# Altium schematic sheet CAMERA.SchDoc
size B
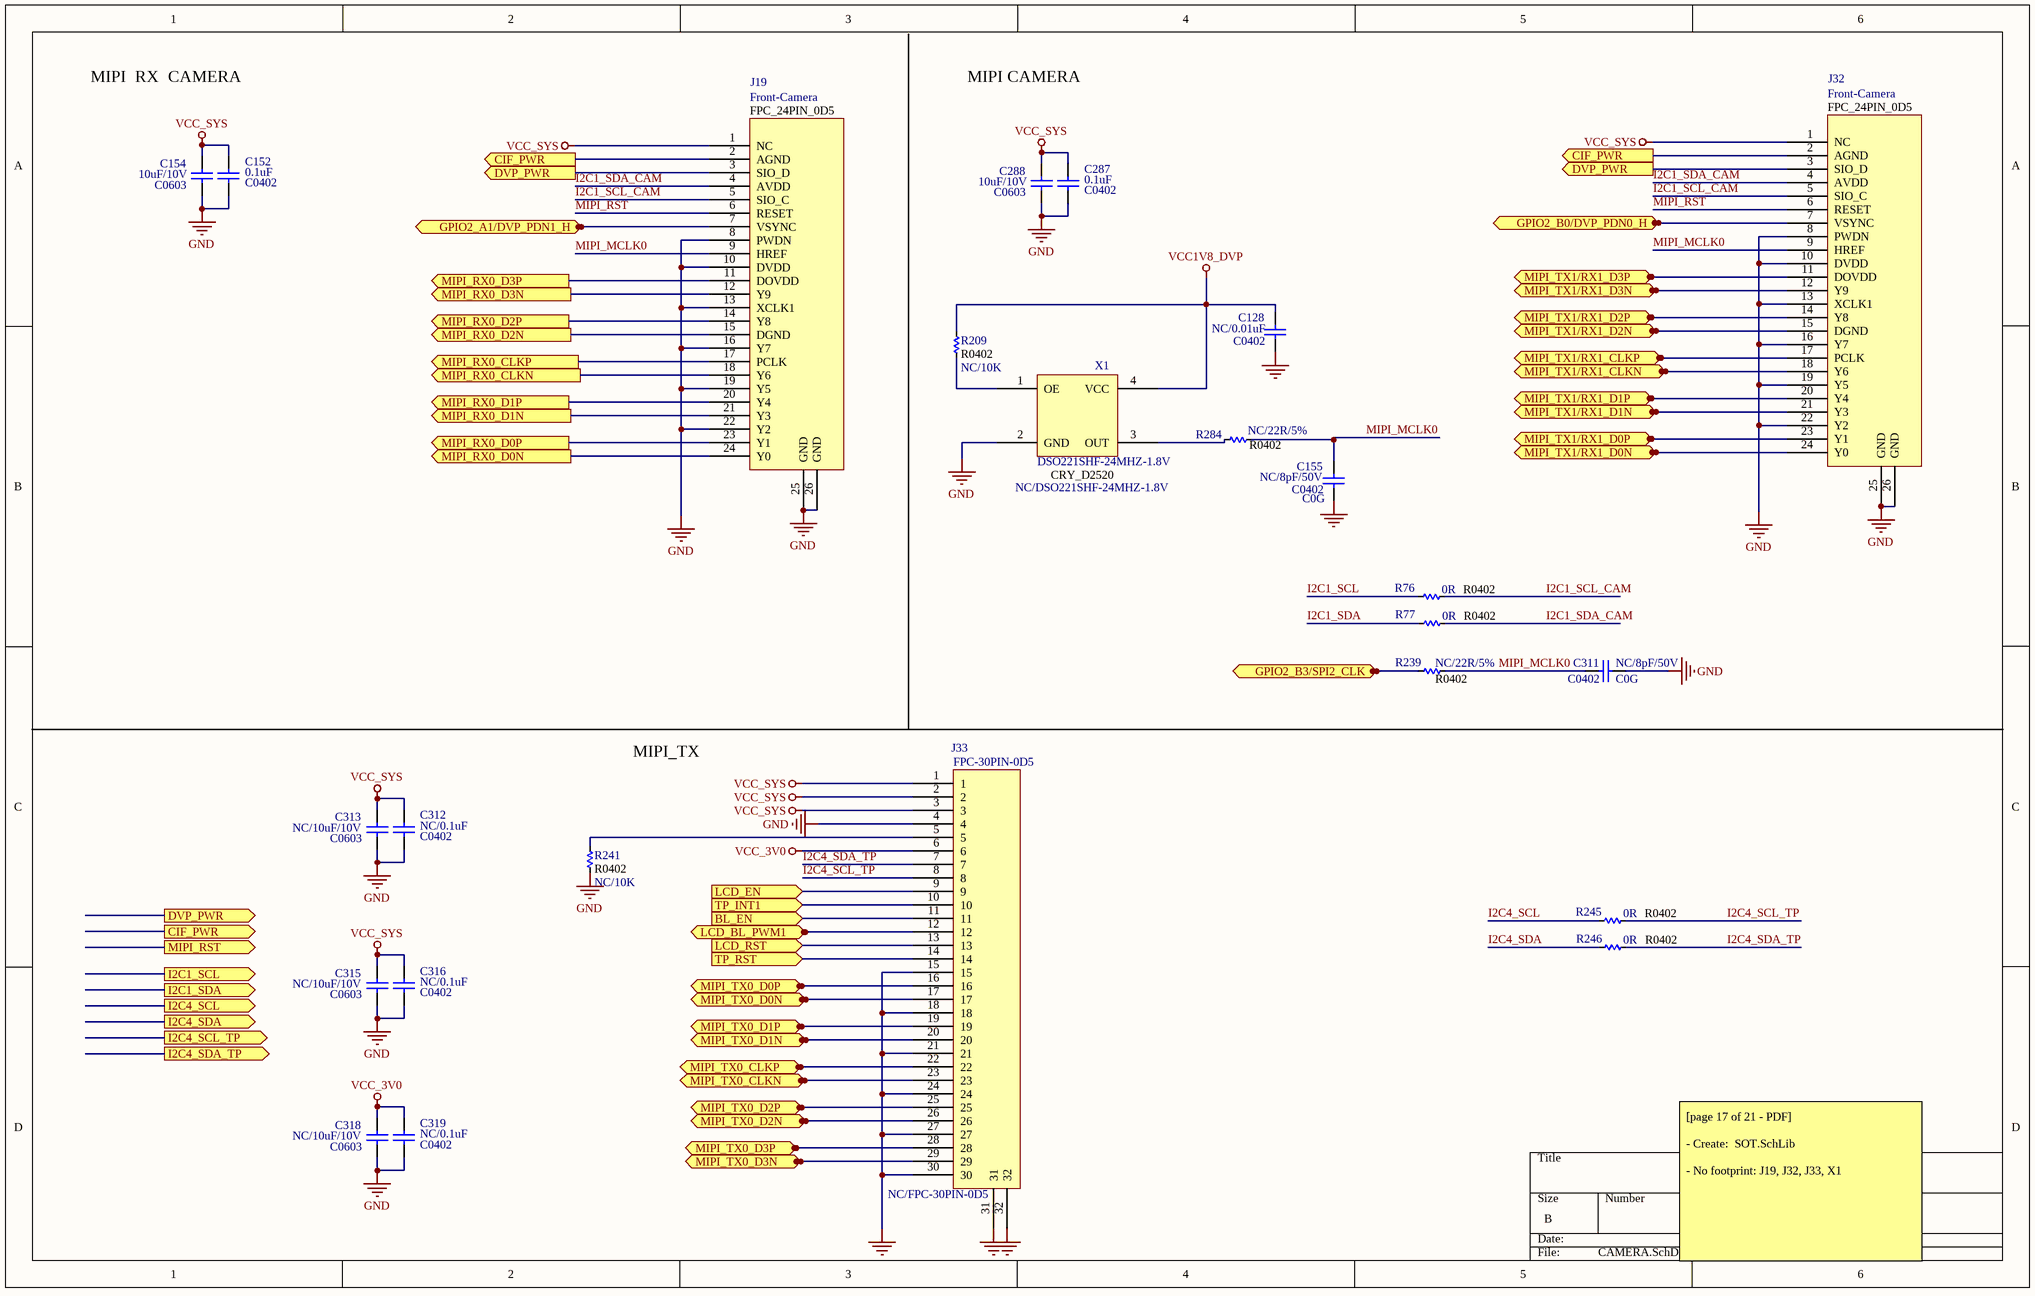
[diagram p0: CAMERA.SchDoc]

## Parts
C128  C0402  value NC/0.01uF  [C 0402]
C152  C0402  value 0.1uF  [C 0402]
C154  C0603  value 10uF/10V  [C 0603]
C155  C0402  value NC/8pF/50V  [C 0402]
C287  C0402  value 0.1uF  [C 0402]
C288  C0603  value 10uF/10V  [C 0603]
C311  C0402  value NC/8pF/50V  [C 0402]
C312  C0402  value NC/0.1uF  [C 0402]
C313  C0603  value NC/10uF/10V  [C 0603]
C315  C0603  value NC/10uF/10V  [C 0603]
C316  C0402  value NC/0.1uF  [C 0402]
C318  C0603  value NC/10uF/10V  [C 0603]
C319  C0402  value NC/0.1uF  [C 0402]
J19  FPC_24PIN_0D5  [FPC-24Pin]  (value not drawn)
J32  FPC_24PIN_0D5  [FPC-24Pin]  (value not drawn)
J33  NC/FPC-30PIN-0D5  [FPC-30pin]
R76  R0402  value 0R  [R 0402]
R77  R0402  value 0R  [R 0402]
R209  R0402  value NC/10K  [R 0402]
R239  R0402  value NC/22R/5%  [R 0402]
R241  R0402  value NC/10K  [R 0402]
R245  R0402  value 0R  [R 0402]
R246  R0402  value 0R  [R 0402]
R284  R0402  value NC/22R/5%  [R 0402]
X1  CRY_D2520  [Crystal 4-SMD 32x25]  (value not drawn)

## Ports
BL_EN (in), CIF_PWR (out), DVP_PWR (out), GPIO2_A1/DVP_PDN1_H (in), GPIO2_B0/DVP_PDN0_H (in), GPIO2_B3/SPI2_CLK (in), I2C1_SCL (out), I2C1_SDA (out), I2C4_SCL (out), I2C4_SCL_TP (out), I2C4_SDA (out), I2C4_SDA_TP (out), LCD_BL_PWM1 (in), LCD_EN (in), LCD_RST (in), MIPI_RST (out), MIPI_RX0_CLKN (out), MIPI_RX0_CLKP (out), MIPI_RX0_D0N (out), MIPI_RX0_D0P (out), MIPI_RX0_D1N (out), MIPI_RX0_D1P (out), MIPI_RX0_D2N (out), MIPI_RX0_D2P (out), MIPI_RX0_D3N (out), MIPI_RX0_D3P (out), MIPI_TX0_CLKN (in), MIPI_TX0_CLKP (in), MIPI_TX0_D0N (in), MIPI_TX0_D0P (in), MIPI_TX0_D1N (in), MIPI_TX0_D1P (in), MIPI_TX0_D2N (in), MIPI_TX0_D2P (in), MIPI_TX0_D3N (in), MIPI_TX0_D3P (in), MIPI_TX1/RX1_CLKN (out), MIPI_TX1/RX1_CLKP (out), MIPI_TX1/RX1_D0N (out), MIPI_TX1/RX1_D0P (out), MIPI_TX1/RX1_D1N (out), MIPI_TX1/RX1_D1P (out), MIPI_TX1/RX1_D2N (out), MIPI_TX1/RX1_D2P (out), MIPI_TX1/RX1_D3N (out), MIPI_TX1/RX1_D3P (out), TP_INT1 (in), TP_RST (in)

## Nets
GND: C128.2 C152.2 C154.2 C155.2 C287.2 C288.2 C311.2 C312.2 C313.2 C315.2 C316.2 C318.2 C319.2 J19.8(PWDN) J19.10(DVDD) J19.13(XCLK1) J19.16(Y7) J19.19(Y5) J19.22(Y2) J19.25(GND) J19.26(GND) J32.8(PWDN) J32.10(DVDD) J32.13(XCLK1) J32.16(Y7) J32.19(Y5) J32.22(Y2) J32.25(GND) J32.26(GND) J33.4 J33.15 J33.18 J33.21 J33.24 J33.27 J33.30 J33.31 J33.32 R241.2 X1.2(GND)
VCC1V8_DVP: C128.1 R209.1 X1.4(VCC)
VCC_3V0: C318.1 C319.1 J33.6
VCC_SYS: C152.1 C154.1 C287.1 C288.1 C312.1 C313.1 C315.1 C316.1 J19.1(NC) J32.1(NC) J33.1 J33.2 J33.3
BL_EN: J33.11 ; port BL_EN
CIF_PWR: J19.2(AGND) J32.2(AGND) ; port CIF_PWR
DVP_PWR: J19.3(SIO_D) J32.3(SIO_D) ; port DVP_PWR
GPIO2_A1/DVP_PDN1_H: J19.7(VSYNC) ; port GPIO2_A1/DVP_PDN1_H
GPIO2_B0/DVP_PDN0_H: J32.7(VSYNC) ; port GPIO2_B0/DVP_PDN0_H
GPIO2_B3/SPI2_CLK: R239.1 ; port GPIO2_B3/SPI2_CLK
I2C1_SCL: R76.1
I2C1_SCL_CAM: J19.5(SIO_C) J32.5(SIO_C) R76.2
I2C1_SDA: R77.1
I2C1_SDA_CAM: J19.4(AVDD) J32.4(AVDD) R77.2
I2C4_SCL: R245.1
I2C4_SCL_TP: J33.8 R245.2
I2C4_SDA: R246.1
I2C4_SDA_TP: J33.7 R246.2
LCD_BL_PWM1: J33.12 ; port LCD_BL_PWM1
LCD_EN: J33.9 ; port LCD_EN
LCD_RST: J33.13 ; port LCD_RST
MIPI_MCLK0: C155.1 C311.1 J19.9(HREF) J32.9(HREF) R239.2 R284.2
MIPI_RST: J19.6(RESET) J32.6(RESET)
MIPI_RX0_CLKN: J19.18(Y6) ; port MIPI_RX0_CLKN
MIPI_RX0_CLKP: J19.17(PCLK) ; port MIPI_RX0_CLKP
MIPI_RX0_D0N: J19.24(Y0) ; port MIPI_RX0_D0N
MIPI_RX0_D0P: J19.23(Y1) ; port MIPI_RX0_D0P
MIPI_RX0_D1N: J19.21(Y3) ; port MIPI_RX0_D1N
MIPI_RX0_D1P: J19.20(Y4) ; port MIPI_RX0_D1P
MIPI_RX0_D2N: J19.15(DGND) ; port MIPI_RX0_D2N
MIPI_RX0_D2P: J19.14(Y8) ; port MIPI_RX0_D2P
MIPI_RX0_D3N: J19.12(Y9) ; port MIPI_RX0_D3N
MIPI_RX0_D3P: J19.11(DOVDD) ; port MIPI_RX0_D3P
MIPI_TX0_CLKN: J33.23 ; port MIPI_TX0_CLKN
MIPI_TX0_CLKP: J33.22 ; port MIPI_TX0_CLKP
MIPI_TX0_D0N: J33.17 ; port MIPI_TX0_D0N
MIPI_TX0_D0P: J33.16 ; port MIPI_TX0_D0P
MIPI_TX0_D1N: J33.20 ; port MIPI_TX0_D1N
MIPI_TX0_D1P: J33.19 ; port MIPI_TX0_D1P
MIPI_TX0_D2N: J33.26 ; port MIPI_TX0_D2N
MIPI_TX0_D2P: J33.25 ; port MIPI_TX0_D2P
MIPI_TX0_D3N: J33.29 ; port MIPI_TX0_D3N
MIPI_TX0_D3P: J33.28 ; port MIPI_TX0_D3P
MIPI_TX1/RX1_CLKN: J32.18(Y6) ; port MIPI_TX1/RX1_CLKN
MIPI_TX1/RX1_CLKP: J32.17(PCLK) ; port MIPI_TX1/RX1_CLKP
MIPI_TX1/RX1_D0N: J32.24(Y0) ; port MIPI_TX1/RX1_D0N
MIPI_TX1/RX1_D0P: J32.23(Y1) ; port MIPI_TX1/RX1_D0P
MIPI_TX1/RX1_D1N: J32.21(Y3) ; port MIPI_TX1/RX1_D1N
MIPI_TX1/RX1_D1P: J32.20(Y4) ; port MIPI_TX1/RX1_D1P
MIPI_TX1/RX1_D2N: J32.15(DGND) ; port MIPI_TX1/RX1_D2N
MIPI_TX1/RX1_D2P: J32.14(Y8) ; port MIPI_TX1/RX1_D2P
MIPI_TX1/RX1_D3N: J32.12(Y9) ; port MIPI_TX1/RX1_D3N
MIPI_TX1/RX1_D3P: J32.11(DOVDD) ; port MIPI_TX1/RX1_D3P
TP_INT1: J33.10 ; port TP_INT1
TP_RST: J33.14 ; port TP_RST
NetJ33_5: J33.5 R241.1
NetR209_2: R209.2 X1.1(OE)
NetR284_1: R284.1 X1.3(OUT)

## Notes on the sheet
- MIPI  RX  CAMERA
- MIPI CAMERA
- MIPI_TX
- [page 17 of 21 - PDF]
  - Create:  SOT.SchLib
  - No footprint: J19, J32, J33, X1
- (in symbol Cap) C0G
- (in symbol CRY_D2520) DSO221SHF-24MHZ-1.8V; NC/DSO221SHF-24MHZ-1.8V
- (in symbol FPC_24PIN_0D5) Front-Camera

## Library data of the parts
C128 C152 C154 C155 C287 C288 C311-C313 C315 C316 C318 C319 = Cap: Capacitor; Published: 8-Jun-2000; LatestRevisionDate: 17-Jul-2002; LatestRevisionNote: Re-released for DXP Platform.; PackageReference: RAD-0.3; Publisher: Altium Limited; PackageDescription: Radial Cap, Thru-Hole; 2 Leads; 0.3 in Pin Spacing
J33 = FPC-30PIN-0D5
R76 R77 R209 R239 R241 R245 R246 R284 = Res-SMD: Resistor; Manufacturer: Generic Components; Class: Passive; Published: 08/06/2000; Publisher: Altium Hobart Technology Centre